# Altium schematic sheet BMS.SchDoc
size A
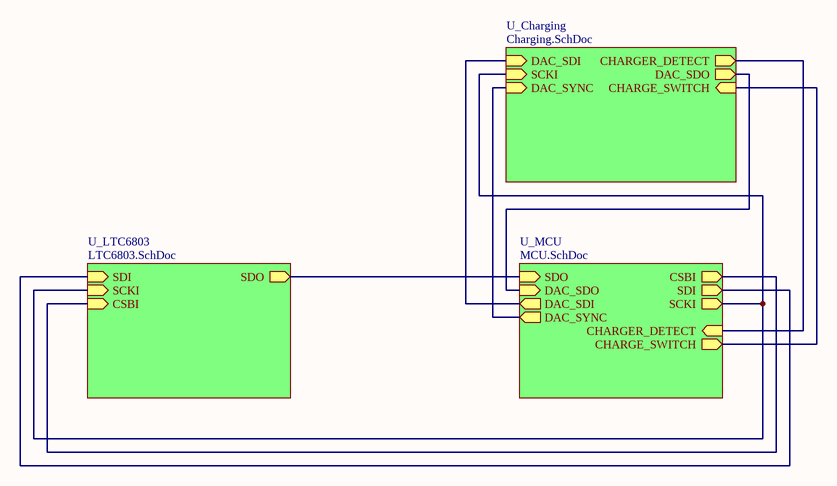
[diagram p0: BMS.SchDoc]

## Sub-sheets
U_Charging = Charging.SchDoc: CHARGER_DETECT (out), DAC_SDI (in), DAC_SDO (out), DAC_SYNC (in), SCKI (in), CHARGE_SWITCH (in)
U_LTC6803 = LTC6803.SchDoc: SDI (in), SCKI (in), SDO (out), CSBI (in)
U_MCU = MCU.SchDoc: CSBI (out), SDI (out), SDO (in), SCKI (out), DAC_SDO (in), DAC_SYNC (out), DAC_SDI (out), CHARGER_DETECT (in), CHARGE_SWITCH (out)

## Nets
(unnamed): sheet U_LTC6803/SDI, sheet U_MCU/SDI
(unnamed): sheet U_LTC6803/SCKI, sheet U_MCU/SCKI, sheet U_Charging/SCKI
(unnamed): sheet U_LTC6803/SDO, sheet U_MCU/SDO
(unnamed): sheet U_LTC6803/CSBI, sheet U_MCU/CSBI
(unnamed): sheet U_MCU/DAC_SDO, sheet U_Charging/DAC_SDO
(unnamed): sheet U_MCU/DAC_SYNC, sheet U_Charging/DAC_SYNC
(unnamed): sheet U_MCU/DAC_SDI, sheet U_Charging/DAC_SDI
(unnamed): sheet U_MCU/CHARGER_DETECT, sheet U_Charging/CHARGER_DETECT
(unnamed): sheet U_MCU/CHARGE_SWITCH, sheet U_Charging/CHARGE_SWITCH